# Altium schematic sheet Relay_NPN.SchDoc: Relay Driver
size A4; CompanyName: github.com/aKaReZa75; Revision: 1.0; SheetNumber: 1; SheetTotal: 1; Project_Name: Design Template
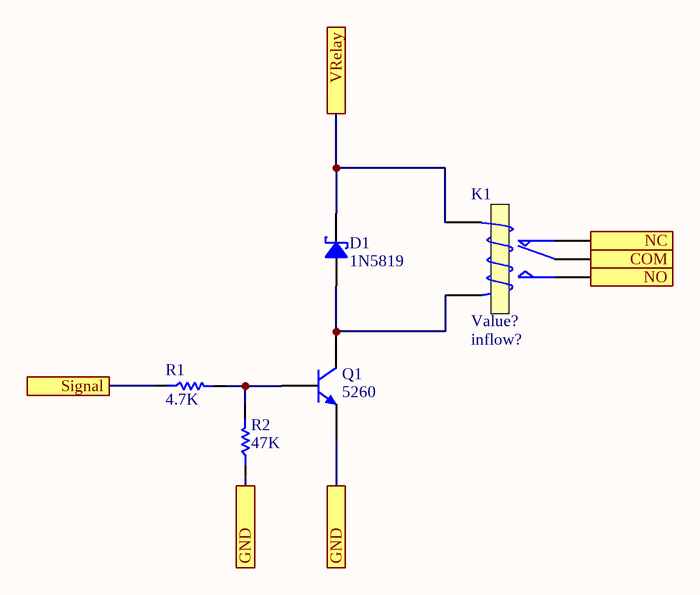
[diagram p0: Relay_NPN.SchDoc]

## Parts
D1  1N5819  [430X270D]
K1  Inflow: inflow?  [Relay 18.85x15.35x15.70]  (hidden comment: Value?)
Q1  Inflow: 5260  [SOT23_N]  (hidden comment: NPN)
R1  4.7K  [RES 0805 (2012X06L)]
R2  47K  [RES 0805 (2012X06L)]

## Ports
COM, GND, NC, NO, Signal, VRelay

## Nets
COM: K1.1(COM) ; port COM
GND: Q1.2(E) R2.1 ; port GND
NC: K1.2(NC) ; port NC
NO: K1.3(NO) ; port NO
Signal: R1.1 ; port Signal
VRelay: D1.2 K1.4(T1) ; port VRelay
NetD1_1: D1.1 K1.5(T2) Q1.3(C)
NetQ1_1: Q1.1(B) R1.2 R2.2

## Notes on the sheet
- Title:
- Project:
- Drawn by:
- Revision:
- Hossein Bagheri
- Company:
- Sheet
- of

## Library data of the parts
D1 = Semi_Diod_Sch_1N5819_SMD: Schottky Rectifiers; Rating: Rating?; Validation: Valid; Inflow: inflow?; Package: SMA; Type: Schottky; Value: 1N5819
K1 = SW_Relay_SPDT: SPDT Relay; Rating: Rating?; Validation: Valid; Type: SPDT; Package: Dip; Value: Value?
Q1 = Semi_BJT_2N2222_SMD: NPN Switching Transistors; Rating: Rating?; Type: Type?; Value: NPN; Package: Package?
R1 R2 = Res_SMD_0805: Resistor; Inflow: inflow?; Rating: 0.125W; Validation: Valid; Package: 0805; Type: 10%
  R1: Value: 4.7K
  R2: Value: 47K